# EAGLE design mux_sh_lite (EAGLE 7.3.0)
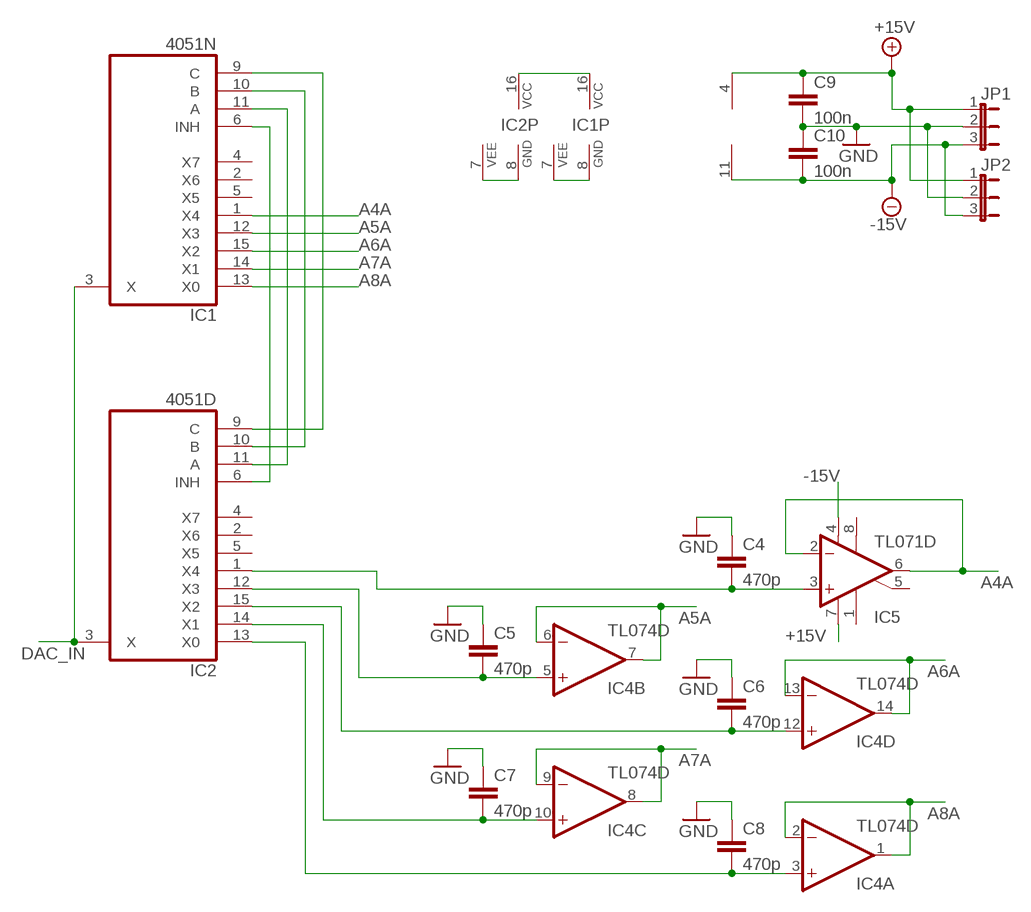
[diagram p0: schematic, sheet 1]

## Parts
C4  470p  CAP0805  [0805]
C5  470p  CAP0805  [0805]
C6  470p  CAP0805  [0805]
C7  470p  CAP0805  [0805]
C8  470p  CAP0805  [0805]
C9  100n  CAP0805  [0805]
C10  100n  CAP0805  [0805]
IC1  4051N  [DIL16]
IC2  4051D  [SO16]
IC4  TL074D  [SO14]
IC5  TL071D  [SO08]
JP1  JP2E  [JP2]
JP2  JP2E  [JP2]

## Nets
4051_GND: IC1.7(VEE) IC1.8(GND)
4051_VCC: IC1.16(VCC) IC2.16(VCC)
+15V: C9.1 IC4.4(P:V+) IC5.7(V+) JP1.1 JP2.1
-15V: C10.2 IC4.11(P:V-) IC5.4(V-) JP1.3 JP2.3
A4A: IC1.1(X4) IC5.2(-IN) IC5.6(OUT)
A5A: IC1.12(X3) IC4.6(B:-IN) IC4.7(B:OUT)
A6A: IC1.15(X2) IC4.13(D:-IN) IC4.14(D:OUT)
A7A: IC1.14(X1) IC4.8(C:OUT) IC4.9(C:-IN)
A8A: IC1.13(X0) IC4.1(A:OUT) IC4.2(A:-IN)
DAC_IN: IC1.3(X) IC2.3(X)
GND: C4.1 C5.1 C6.1 C7.1 C8.1 C9.2 C10.1 JP1.2 JP2.2
N$1: IC2.7(VEE) IC2.8(GND)
N$4: C5.2 IC2.12(X3) IC4.5(B:+IN)
N$5: C4.2 IC2.1(X4) IC5.3(+IN)
N$6: C6.2 IC2.15(X2) IC4.12(D:+IN)
N$7: C7.2 IC2.14(X1) IC4.10(C:+IN)
N$8: C8.2 IC2.13(X0) IC4.3(A:+IN)
N$10: IC1.6(INH) IC2.6(INH)
N$11: IC1.11(A) IC2.11(A)
N$12: IC1.10(B) IC2.10(B)
N$13: IC1.9(C) IC2.9(C)
Unconnected: IC1.2(X6) IC1.4(X7) IC1.5(X5) IC2.2(X6) IC2.4(X7) IC2.5(X5) IC5.1(ON1) IC5.5(ON2) IC5.8(OPT)

## Library data of the parts
C4-C10 = SparkFun-Capacitors:CAP: Capacitor Standard 0603 ceramic capacitor, and 0.1" leaded capacitor.
IC1 IC2 = 40xx:4051: 8-channel ANALOG MULTIPLEXER
IC4 = linear:TL074: OP AMP
IC5 = linear:TL071: OP AMP
JP1 JP2 = jumper:JP2E: JUMPER

## Board
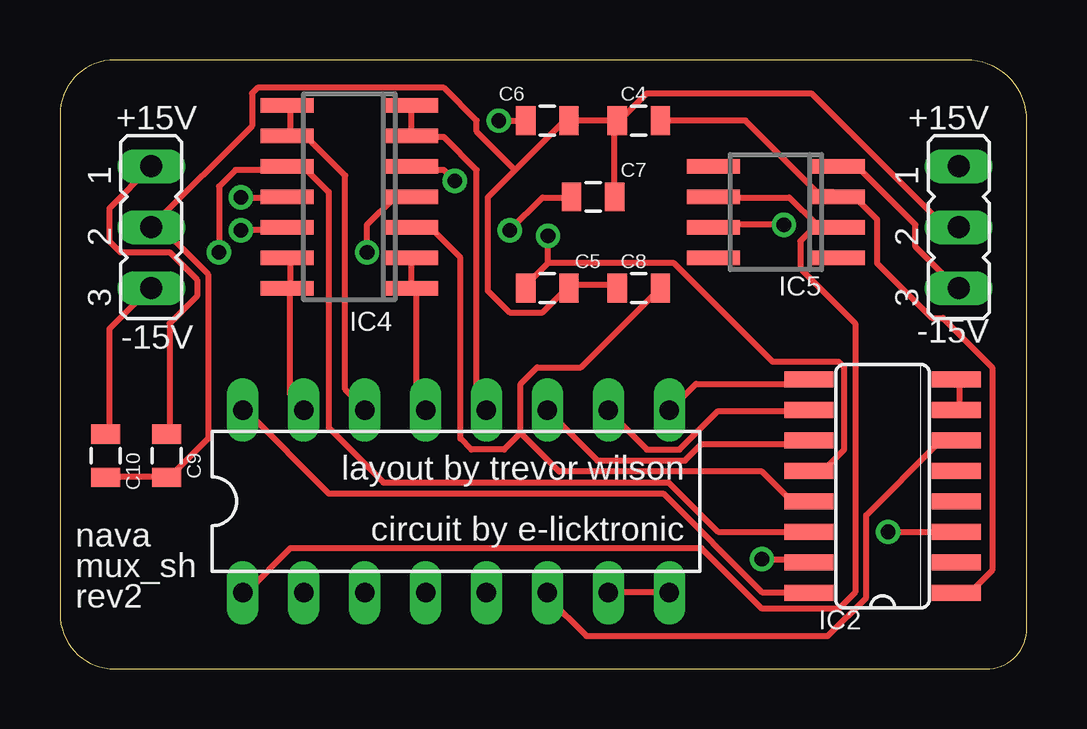
[diagram p1: board, top side]
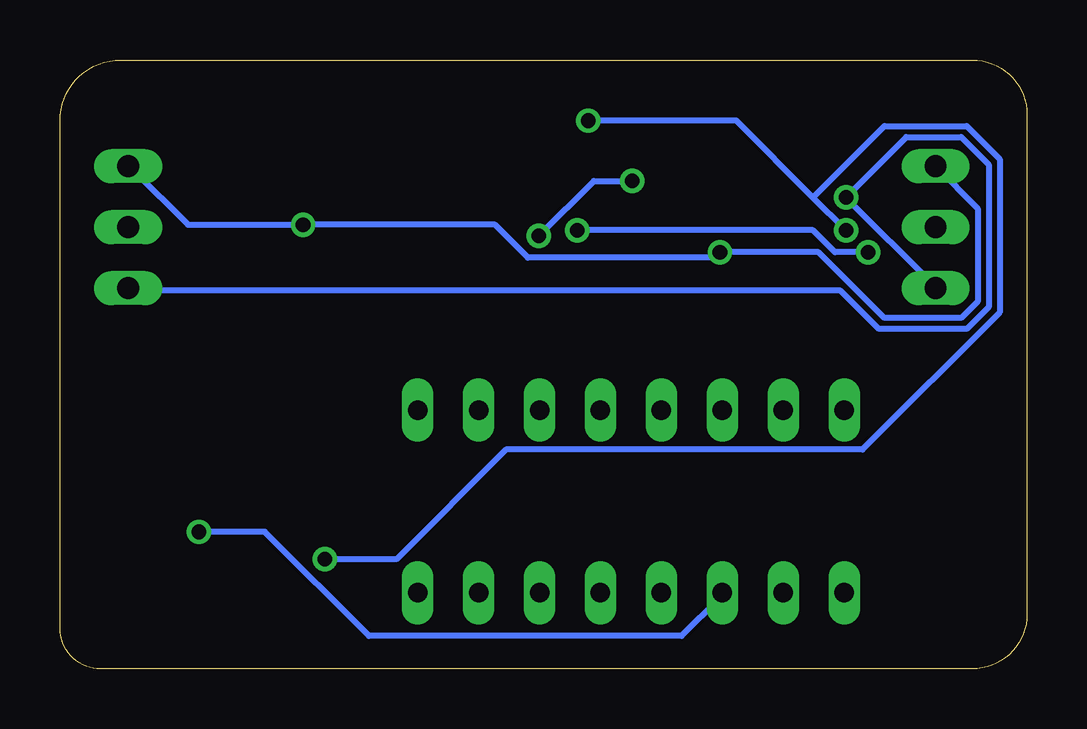
[diagram p2: board, bottom side, seen from below]

Size 40.31 x 25.39 mm. Coordinates in mm from the lower left corner, seen from the top.
Outline: 2.29,0 38.61,0 arc90 40.31,1.7 40.31,22.85 arc90 37.77,25.39 2.28,25.39 arc90 0,23.11 0,2.29 arc90 2.29,0
Copper layers (1*16): Top 0.035mm / dielectric 1.5mm / Bottom 0.035mm
Design rules "default": minimum track width 10mil, minimum drill 24mil, track to track 8mil, track to pad 8mil, pad to pad 8mil, via to via 8mil, smd to smd 8mil, copper to edge 40mil, drill to drill 8mil, minimum pad ring 10mil, minimum via ring 8mil, stop-mask expansion 4mil, vias tented up to drill 0mil, thermal gap 10mil

### Footprints (pad centres in the part's own frame; a part is rotated, then mirrored left to right if it is on the bottom)
0805 = smd 0.8 x 1.2: 1 -0.9,0; 2 0.9,0
DIL16 = drill 0.813 long: 1 -8.89,-3.81; 2 -6.35,-3.81; 3 -3.81,-3.81; 4 -1.27,-3.81; 5 1.27,-3.81; 6 3.81,-3.81; 7 6.35,-3.81; 8 8.89,-3.81; 9 8.89,3.81; 10 6.35,3.81; 11 3.81,3.81; 12 1.27,3.81; 13 -1.27,3.81; 14 -3.81,3.81; 15 -6.35,3.81; 16 -8.89,3.81
SO16 = smd 0.66 x 2.032: 1 -4.445,-3.073; 2 -3.175,-3.073; 3 -1.905,-3.073; 4 -0.635,-3.073; 5 0.635,-3.073; 6 1.905,-3.073; 7 3.175,-3.073; 8 4.445,-3.073; 9 4.445,3.073; 10 3.175,3.073; 11 1.905,3.073; 12 0.635,3.073; 13 -0.635,3.073; 14 -1.905,3.073; 15 -3.175,3.073; 16 -4.445,3.073
SO14 = smd 0.6 x 2.2: 1 -3.81,-2.6; 2 -2.54,-2.6; 3 -1.27,-2.6; 4 0,-2.6; 5 1.27,-2.6; 6 2.54,-2.6; 7 3.81,-2.6; 8 3.81,2.6; 9 2.54,2.6; 10 1.27,2.6; 11 0,2.6; 12 -1.27,2.6; 13 -2.54,2.6; 14 -3.81,2.6
SO08 = smd 0.6 x 2.2: 1 -1.905,-2.6; 2 -0.635,-2.6; 3 0.635,-2.6; 4 1.905,-2.6; 5 1.905,2.6; 6 0.635,2.6; 7 -0.635,2.6; 8 -1.905,2.6
JP2 = drill 0.914 long: 1 -2.54,0; 2 0,0; 3 2.54,0

### Placement (x,y rotation side)
C4  24.13,22.86 0 top
C5  20.32,15.88 180 top
C6  20.32,22.86 180 top
C7  22.23,19.68 180 top
C8  24.13,15.88 0 top
C9  4.45,8.89 270 top
C10  1.91,8.89 90 top
IC1  16.51,6.99 0 top
IC2  34.29,7.62 90 top
IC4  12.06,19.68 90 top
IC5  29.84,19.05 90 top
JP1  3.81,18.41 270 top
JP2  37.47,18.41 270 top

### Tracks (layer width: path | path; a pad name or v marks a point on that pad's centre or on a via)
4051_GND
  Top 0.254: IC1.7 22.86,3.2 25.38,3.2 IC1.8
4051_VCC
  Top 0.254: IC2.16 31.09,3.2 29.26,3.2 25.15,7.32 11.2,7.32 7.77,10.74 IC1.16
+15V  (via drill 0.61)
  Top 0.254: v30.18,18.52 27.43,18.52 IC5.7 | JP1.1 2.06,19.2 2.06,17.83 2.52,17.37 4.57,17.37 5.71,16.23 5.71,15.54 4.57,14.4 4.57,9.83 C9.1 | v12.8,17.37 12.8,18.52 13.95,19.66 14.63,19.66 IC4.4
  Bottom 0.254: JP2.1 37.26,20.8 34.98,18.52 v30.18,18.52 22.17,18.52 20.8,17.14 13.03,17.14 v12.8,17.37 8.69,17.37 5.94,14.63 2.74,14.63 2.06,15.32 2.06,19.2 JP1.1
-15V  (via drill 0.61)
  Top 0.254: IC5.4 32.46,20.8 33.38,20.8 35.66,18.52 35.66,17.6 37.26,16 JP2.3 | C10.2 2.06,9.83 2.06,14.17 3.66,15.77 JP1.3 | v7.54,19.66 9.37,19.66 IC4.11
  Bottom 0.254: JP1.3 3.89,16 v7.54,19.66 5.03,22.17 2.74,22.17 1.6,21.03 1.6,15.09 2.52,14.17 6.17,14.17 7.77,15.77 37.26,15.77 JP2.3
A4A
  Top 0.254: 31.55,18.52 32.23,18.52 IC5.2 31.55,18.52 | 31.55,18.52 30.4,19.66 27.43,19.66 IC5.6 | 31.55,18.52 30.86,17.83 30.86,16.69 33.15,14.4 33.15,3.2 32.46,2.52 29.26,2.52 26.75,5.03 9.6,5.03 7.77,3.2 IC1.1
A5A
  Top 0.254: IC4.7 14.63,23.32 14.63,22.4 IC4.6 14.86,22.17 16,22.17 17.37,20.8 17.37,11.2 IC1.12
A6A
  Top 0.254: IC4.13 9.6,17.14 9.6,16 IC4.14 9.6,15.77 9.6,11.43 10.06,10.97 IC1.15
A7A
  Top 0.254: IC4.8 9.6,23.32 9.6,22.4 IC4.9 9.6,22.17 10.29,22.17 11.89,20.57 11.89,11.66 12.57,10.97 IC1.14
A8A
  Top 0.254: IC4.2 14.63,17.14 14.63,16 IC4.1 14.86,15.77 14.86,11.2 15.09,10.97 IC1.13
DAC_IN  (via drill 0.61)
  Top 0.254: v34.52,5.71 IC2.3
  Bottom 0.254: v34.52,5.71 31.77,5.71 27.43,1.37 14.4,1.37 12.8,2.97 IC1.3
GND
  Top 0.254: C10.1 2.06,8 4.34,8 C9.2 4.57,8 6.17,9.6 6.17,16.46 4.34,18.29 3.89,18.29 JP1.2 3.89,18.52 8,22.63 8,24 8.23,24.23 16,24.23 17.37,22.86 17.37,22.4 18.97,20.8 | C8.1 23.09,16 21.26,16 C5.1 21.03,15.77 20.12,14.86 18.75,14.86 17.83,15.77 17.83,19.66 18.97,20.8 | 23.09,22.86 C6.1 21.03,22.86 18.97,20.8 | 23.09,22.86 23.09,19.89 C7.1 | 23.09,22.86 C4.1 23.32,22.86 24.46,24 31.32,24 36.8,18.52 37.26,18.52 JP2.2
N$1
  Top 0.254: IC2.7 37.49,10.97 37.49,11.89 IC2.8
N$4  (via drill 0.61)
  Top 0.254: 20.34,16.92 19.43,16 C5.2 | 20.34,16.92 25.6,16.92 29.72,12.8 32.46,12.8 32.69,12.57 32.69,9.14 32,8.46 31.32,8.46 IC2.12 | v16.46,20.34 16,20.8 14.86,20.8 IC4.5 | 20.34,16.92 v20.34,18.06
  Bottom 0.254: v16.46,20.34 18.06,20.34 v20.34,18.06
N$5
  Top 0.254: C4.2 28.57,22.86 31.55,19.89 32.23,19.89 IC5.3 32.46,19.66 33.15,19.66 34.06,18.75 34.06,16.92 36.35,14.63 36.8,14.63 38.86,12.57 38.86,4.12 37.95,3.2 37.49,3.2 IC2.1
N$6  (via drill 0.61)
  Top 0.254: v18.29,22.86 C6.2 | v7.54,18.29 9.37,18.29 IC4.12 | v29.26,4.57 31.09,4.57 IC2.15
  Bottom 0.254: v18.29,22.86 12.12,22.86 8.91,19.66 | v7.54,18.29 8.91,19.66 | v29.26,4.57 26.29,4.57 21.72,9.14 6.86,9.14 1.14,14.86 1.14,21.26 2.52,22.63 5.94,22.63 8.91,19.66
N$7  (via drill 0.61)
  Top 0.254: v18.75,18.29 20.12,19.66 21.26,19.66 C7.2 | v6.63,17.37 6.63,20.12 7.32,20.8 9.37,20.8 IC4.10 9.6,20.8 10.29,20.8 11.2,19.89 11.2,10.06 13.49,7.77 25.38,7.77 27.43,5.71 IC2.14
  Bottom 0.254: v18.75,18.29 8.91,18.29 8,17.37 v6.63,17.37
N$8
  Top 0.254: 19.2,9.83 19.2,11.89 19.89,12.57 21.72,12.57 24.92,15.77 C8.2 | 19.2,9.83 20.8,8.23 29.26,8.23 30.4,7.09 31.09,7.09 IC2.13 | 19.2,9.83 18.52,9.14 17.14,9.14 16.69,9.6 16.69,17.14 15.54,18.29 14.86,18.29 IC4.3
N$10
  Top 0.254: IC2.6 37.26,9.37 36.58,9.37 33.6,6.4 33.6,2.97 32,1.37 21.95,1.37 20.34,2.97 IC1.6
N$11
  Top 0.254: IC2.11 31.09,9.37 26.75,9.37 26.06,8.69 22.4,8.69 20.34,10.74 IC1.11
N$12
  Top 0.254: IC2.10 31.09,10.74 27.43,10.74 25.83,9.14 24.46,9.14 22.86,10.74 IC1.10
N$13
  Top 0.254: IC2.9 31.09,11.89 26.52,11.89 25.6,10.97 IC1.9

### Text on the board
tNames: +15V | +15V | -15V | -15V | layout by trevor wilson | circuit by e-licktronic | nava | mux_sh | rev2